# EAGLE design untitled (EAGLE 5.06)
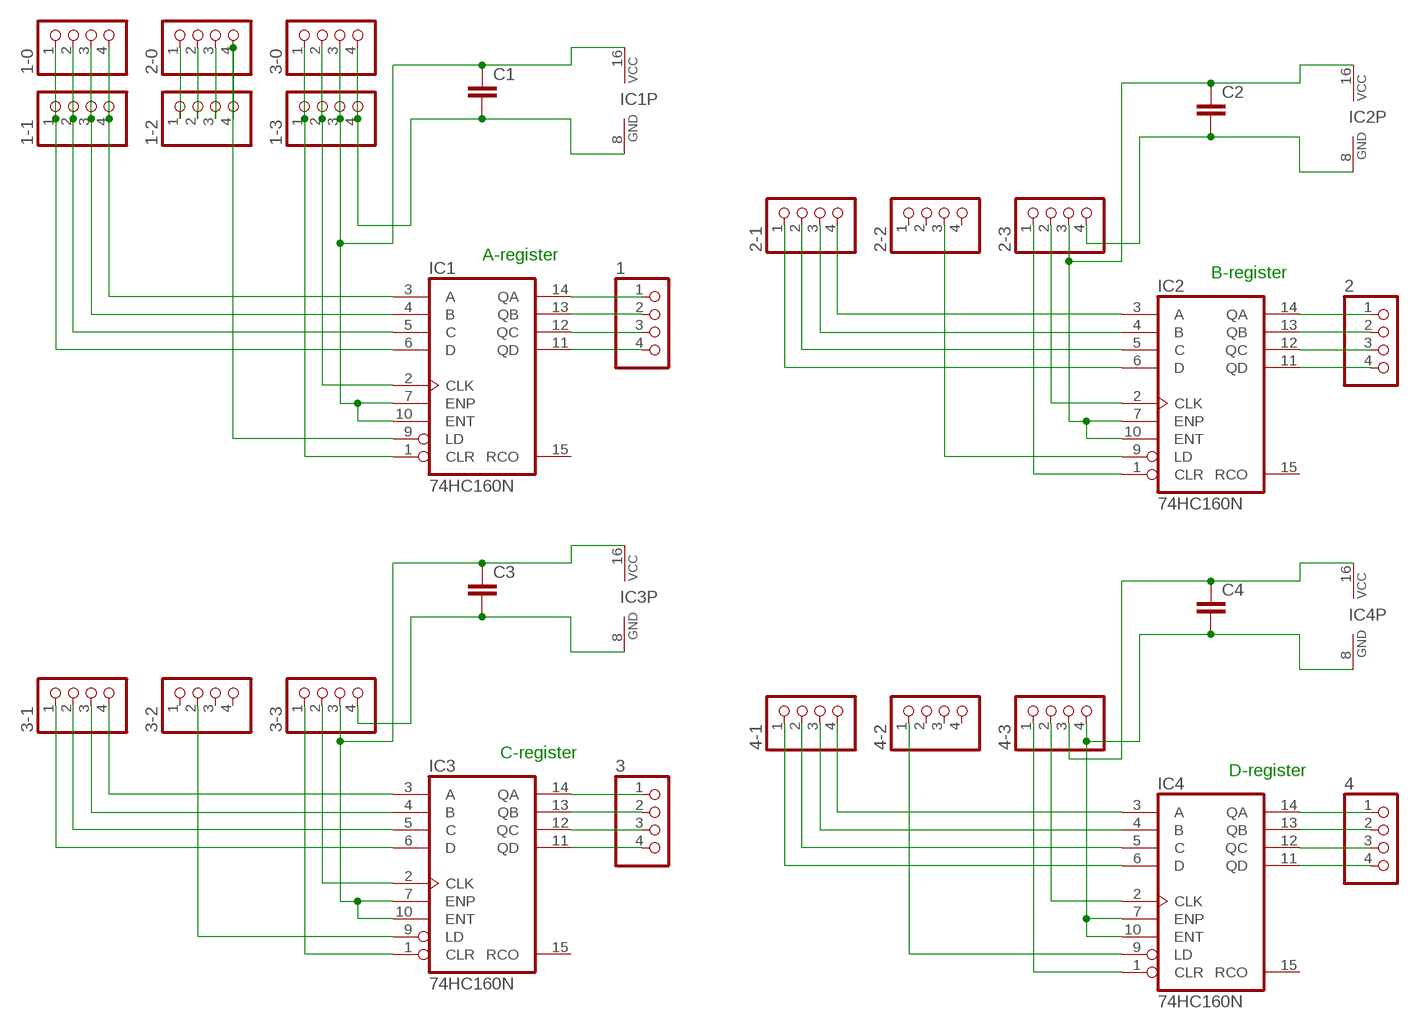
[diagram p0: schematic, sheet 1]

## Parts
1  PINHD-1X4  [1X04]
1-0  PINHD-1X4  [1X04]
1-1  PINHD-1X4  [1X04]
1-2  PINHD-1X4  [1X04]
1-3  PINHD-1X4  [1X04]
2  PINHD-1X4  [1X04]
2-0  PINHD-1X4  [1X04]
2-1  PINHD-1X4  [1X04]
2-2  PINHD-1X4  [1X04]
2-3  PINHD-1X4  [1X04]
3  PINHD-1X4  [1X04]
3-0  PINHD-1X4  [1X04]
3-1  PINHD-1X4  [1X04]
3-2  PINHD-1X4  [1X04]
3-3  PINHD-1X4  [1X04]
4  PINHD-1X4  [1X04]
4-1  PINHD-1X4  [1X04]
4-2  PINHD-1X4  [1X04]
4-3  PINHD-1X4  [1X04]
C1  C-EU050-030X075  [C050-030X075]
C2  C-EU050-030X075  [C050-030X075]
C3  C-EU050-030X075  [C050-030X075]
C4  C-EU050-030X075  [C050-030X075]
IC1  74HC160N  [DIL16]
IC2  74HC160N  [DIL16]
IC3  74HC160N  [DIL16]
IC4  74HC160N  [DIL16]

## Nets
N$1: 1-2.4 2-0.4 IC1.9(LD)
N$2: 2-2.3 IC2.9(LD)
N$3: 2-1.4 IC2.3(A)
N$4: 2-1.3 IC2.4(B)
N$5: 1-0.4 1-1.4 IC1.3(A)
N$6: 1-0.3 1-1.3 IC1.4(B)
N$7: 1-0.2 1-1.2 IC1.5(C)
N$8: 1-0.1 1-1.1 IC1.6(D)
N$9: 1-3.1 3-0.1 IC1.1(CLR)
N$10: 1-3.2 3-0.2 IC1.2(CLK)
N$11: 1.1 IC1.14(QA)
N$12: 1.2 IC1.13(QB)
N$13: 1.3 IC1.12(QC)
N$14: 1.4 IC1.11(QD)
N$15: 2-1.2 IC2.5(C)
N$16: 2-1.1 IC2.6(D)
N$17: 2-3.1 IC2.1(CLR)
N$18: 2-3.2 IC2.2(CLK)
N$19: 2.1 IC2.14(QA)
N$20: 2.2 IC2.13(QB)
N$21: 2.3 IC2.12(QC)
N$22: 2.4 IC2.11(QD)
N$23: 3-2.2 IC3.9(LD)
N$24: 3-1.4 IC3.3(A)
N$25: 3-1.3 IC3.4(B)
N$26: 3-1.2 IC3.5(C)
N$27: 3-1.1 IC3.6(D)
N$28: 3-3.1 IC3.1(CLR)
N$29: 3-3.2 IC3.2(CLK)
N$30: 3.1 IC3.14(QA)
N$31: 3.2 IC3.13(QB)
N$32: 3.3 IC3.12(QC)
N$33: 3.4 IC3.11(QD)
N$34: 4-2.1 IC4.9(LD)
N$35: 4-1.4 IC4.3(A)
N$36: 4-1.3 IC4.4(B)
N$37: 4-1.2 IC4.5(C)
N$38: 4-1.1 IC4.6(D)
N$39: 4-3.1 IC4.1(CLR)
N$40: 4-3.2 IC4.2(CLK)
N$41: 4.1 IC4.14(QA)
N$42: 4.2 IC4.13(QB)
N$43: 4.3 IC4.12(QC)
N$44: 4.4 IC4.11(QD)
N$45: 1-2.1 2-0.1
N$46: 1-2.2 2-0.2
N$47: 1-2.3 2-0.3
N$48: 1-3.3 3-0.3 C1.1 IC1.7(ENP) IC1.10(ENT) IC1.16(VCC)
N$49: 1-3.4 3-0.4 C1.2 IC1.8(GND)
N$50: 3-3.3 C3.1 IC3.7(ENP) IC3.10(ENT) IC3.16(VCC)
N$51: 3-3.4 C3.2 IC3.8(GND)
N$52: 4-3.4 C4.2 IC4.7(ENP) IC4.8(GND) IC4.10(ENT)
N$53: 4-3.3 C4.1 IC4.16(VCC)
N$54: 2-3.3 C2.1 IC2.7(ENP) IC2.10(ENT) IC2.16(VCC)
N$55: 2-3.4 C2.2 IC2.8(GND)
Unconnected: 2-2.1 2-2.2 2-2.4 3-2.1 3-2.3 3-2.4 4-2.2 4-2.3 4-2.4 IC1.15(RCO) IC2.15(RCO) IC3.15(RCO) IC4.15(RCO)

## Notes on the sheet
- A-register
- B-register
- C-register
- D-register

## Library data of the parts
1 1-0 1-1-1-3 2 2-0 2-1-2-3 3 3-0 3-1-3-3 4 4-1-4-3 = pinhead:PINHD-1X4: PIN HEADER
C1-C4 = resistor:C-EU: CAPACITOR, European symbol
IC1-IC4 = 74xx-eu:74*160: Synchronous 4-bit COUNTER

## Board
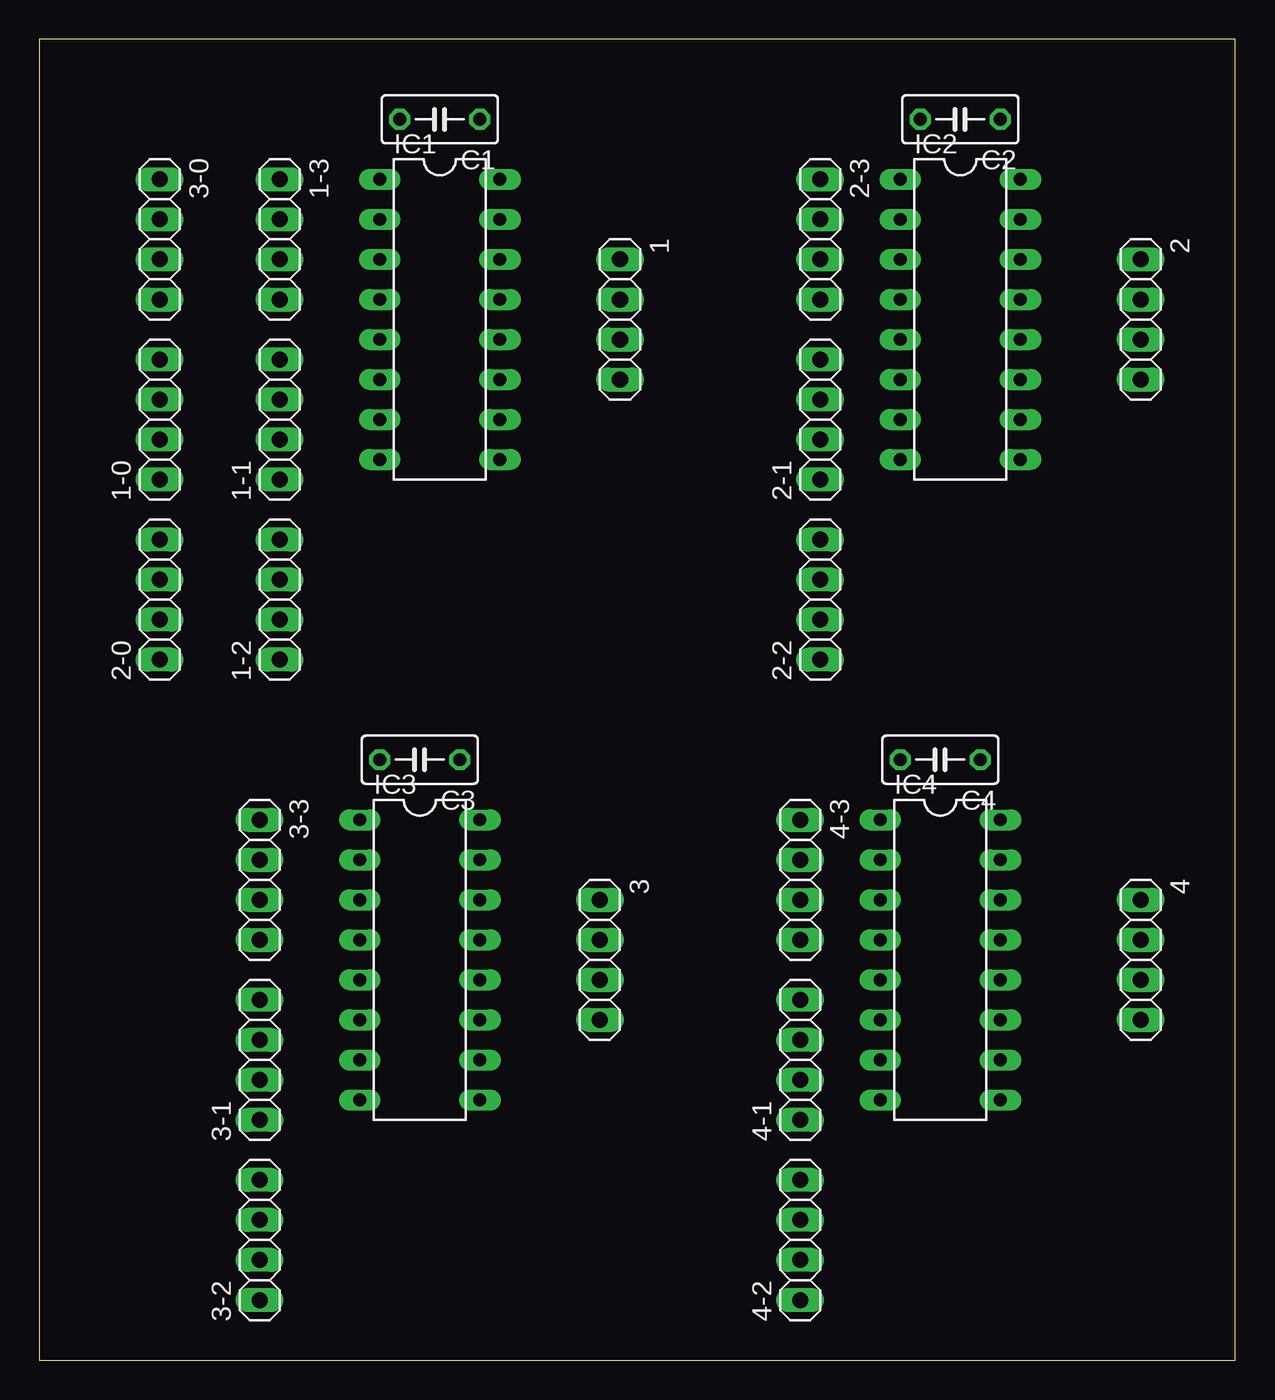
[diagram p1: board, top side]
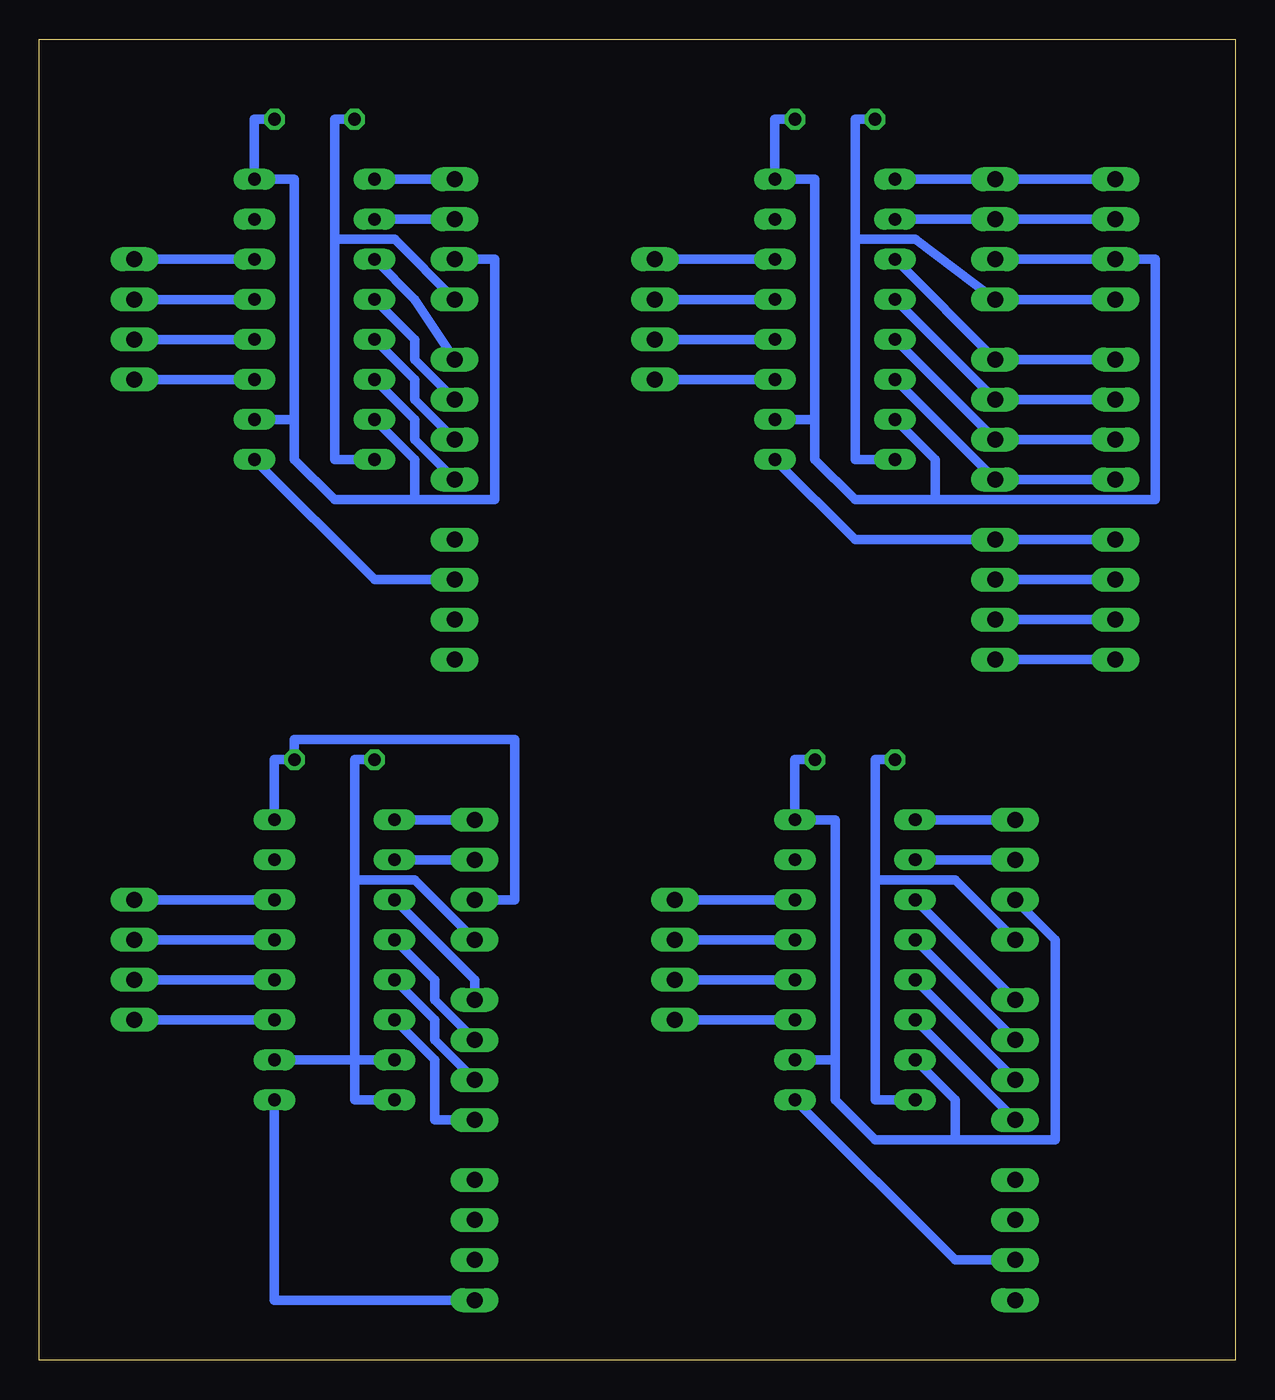
[diagram p2: board, bottom side, seen from below]

Size 75.87 x 83.81 mm. Coordinates in mm from the lower left corner, seen from the top.
Outline: 0,0 75.87,0 75.87,83.81 0,83.81 0,0
Copper layers (1*16): Top 0.035mm / dielectric 1.5mm / Bottom 0.035mm
Design rules "default": minimum track width 10mil, minimum drill 24mil, track to track 8mil, track to pad 8mil, pad to pad 8mil, via to via 8mil, smd to smd 8mil, copper to edge 40mil, drill to drill 8mil, minimum pad ring 10mil, minimum via ring 8mil, stop-mask expansion 4mil, vias tented up to drill 0mil, thermal gap 10mil

### Footprints (pad centres in the part's own frame; a part is rotated, then mirrored left to right if it is on the bottom)
1X04 = drill 1.016 long: 1 -3.81,0; 2 -1.27,0; 3 1.27,0; 4 3.81,0
C050-030X075 = drill 0.813 octagon: 1 -2.54,0; 2 2.54,0
DIL16 = drill 0.813 long: 1 -8.89,-3.81; 2 -6.35,-3.81; 3 -3.81,-3.81; 4 -1.27,-3.81; 5 1.27,-3.81; 6 3.81,-3.81; 7 6.35,-3.81; 8 8.89,-3.81; 9 8.89,3.81; 10 6.35,3.81; 11 3.81,3.81; 12 1.27,3.81; 13 -1.27,3.81; 14 -3.81,3.81; 15 -6.35,3.81; 16 -8.89,3.81

### Placement (x,y rotation side)
1  36.83,66.04 270 top
1-0  7.62,59.69 90 top
1-1  15.24,59.69 90 top
1-2  15.24,48.26 90 top
1-3  15.24,71.12 270 top
2  69.85,66.04 270 top
2-0  7.62,48.26 90 top
2-1  49.53,59.69 90 top
2-2  49.53,48.26 90 top
2-3  49.53,71.12 270 top
3  35.56,25.4 270 top
3-0  7.62,71.12 270 top
3-1  13.97,19.05 90 top
3-2  13.97,7.62 90 top
3-3  13.97,30.48 270 top
4  69.85,25.4 270 top
4-1  48.26,19.05 90 top
4-2  48.26,7.62 90 top
4-3  48.26,30.48 270 top
C1  25.4,78.74 180 top
C2  58.42,78.74 180 top
C3  24.13,38.1 180 top
C4  57.15,38.1 180 top
IC1  25.4,66.04 270 top
IC2  58.42,66.04 270 top
IC3  24.13,25.4 270 top
IC4  57.15,25.4 270 top

### Tracks (layer width: path | path; a pad name or v marks a point on that pad's centre or on a via)
N$1
  Bottom 0.61: IC1.9 24.13,52.07 1-2.4 2-0.4
N$2
  Bottom 0.61: IC2.9 54.61,49.53 2-2.3
N$3
  Bottom 0.61: IC2.3 52.07,67.31 2-1.4
N$4
  Bottom 0.61: IC2.4 52.07,64.77 52.07,63.5 2-1.3
N$5
  Bottom 0.61: IC1.3 1-1.4 1-0.4
N$6
  Bottom 0.61: IC1.4 1-1.3 1-0.3
N$7
  Bottom 0.61: IC1.5 1-1.2 1-0.2
N$8
  Bottom 0.61: IC1.6 1-1.1 1-0.1
N$9
  Bottom 0.61: IC1.1 1-3.1 3-0.1
N$10
  Bottom 0.61: IC1.2 1-3.2 3-0.2
N$11
  Bottom 0.61: IC1.14 1.1
N$12
  Bottom 0.61: IC1.13 1.2
N$13
  Bottom 0.61: IC1.12 1.3
N$14
  Bottom 0.61: IC1.11 1.4
N$15
  Bottom 0.61: IC2.5 52.07,62.23 52.07,60.96 2-1.2
N$16
  Bottom 0.61: IC2.6 52.07,59.69 52.07,58.42 2-1.1
N$17
  Bottom 0.61: 2-3.1 IC2.1
N$18
  Bottom 0.61: 2-3.2 IC2.2
N$19
  Bottom 0.61: IC2.14 2.1
N$20
  Bottom 0.61: IC2.13 2.2
N$21
  Bottom 0.61: IC2.12 2.3
N$22
  Bottom 0.61: IC2.11 2.4
N$23
  Bottom 0.61: IC3.9 17.78,6.35 3-2.2
N$24
  Bottom 0.61: 3-1.4 IC3.3
N$25
  Bottom 0.61: 3-1.3 IC3.4
N$26
  Bottom 0.61: 3-1.2 IC3.5
N$27
  Bottom 0.61: 3-1.1 IC3.6
N$28
  Bottom 0.61: 3-3.1 IC3.1
N$29
  Bottom 0.61: 3-3.2 IC3.2
N$30
  Bottom 0.61: IC3.14 3.1
N$31
  Bottom 0.61: IC3.13 3.2
N$32
  Bottom 0.61: IC3.12 3.3
N$33
  Bottom 0.61: IC3.11 3.4
N$34
  Bottom 0.61: IC4.9 60.96,3.81 4-2.1
N$35
  Bottom 0.61: IC4.3 48.26,24.13 4-1.4
N$36
  Bottom 0.61: IC4.4 50.8,24.13 50.8,22.86 4-1.3
N$37
  Bottom 0.61: IC4.5 50.8,21.59 50.8,20.32 4-1.2
N$38
  Bottom 0.61: IC4.6 50.8,19.05 50.8,15.24 4-1.1
N$39
  Bottom 0.61: 4-3.1 IC4.1
N$40
  Bottom 0.61: 4-3.2 IC4.2
N$41
  Bottom 0.61: IC4.14 4.1
N$42
  Bottom 0.61: IC4.13 4.2
N$43
  Bottom 0.61: IC4.12 4.3
N$44
  Bottom 0.61: IC4.11 4.4
N$45
  Bottom 0.61: 2-0.1 1-2.1
N$46
  Bottom 0.61: 2-0.2 1-2.2
N$47
  Bottom 0.61: 2-0.3 1-2.3
N$48
  Bottom 0.61: C1.1 29.21,78.74 IC1.16 26.67,74.93 26.67,59.69 | 1-3.3 3-0.3 5.08,69.85 5.08,54.61 19.05,54.61 | IC1.7 19.05,57.15 19.05,54.61 | 19.05,54.61 24.13,54.61 26.67,57.15 26.67,59.69 | IC1.10 26.67,59.69
N$49
  Bottom 0.61: C1.2 24.13,78.74 24.13,71.12 | 24.13,71.12 24.13,57.15 IC1.8 | 3-0.4 1-3.4 20.32,71.12 24.13,71.12
N$50
  Bottom 0.61: C3.1 27.94,38.1 IC3.16 25.4,34.29 25.4,19.05 | IC3.7 17.78,16.51 17.78,13.97 | 17.78,13.97 22.86,13.97 25.4,16.51 25.4,19.05 | 3-3.3 11.43,26.67 11.43,13.97 17.78,13.97 | IC3.10 25.4,19.05
N$51
  Bottom 0.61: C3.2 22.86,38.1 22.86,30.48 | 22.86,30.48 22.86,16.51 IC3.8 | 3-3.4 17.78,30.48 22.86,30.48
N$52
  Bottom 0.61: C4.2 55.88,38.1 55.88,30.48 | 55.88,19.05 55.88,16.51 IC4.8 | 55.88,19.05 55.88,30.48 | 55.88,19.05 IC4.7 | 55.88,19.05 IC4.10 | 4-3.4 52.07,30.48 55.88,30.48
N$53
  Bottom 0.61: IC4.16 60.96,38.1 C4.1 59.69,39.37 45.72,39.37 45.72,29.21 4-3.3
N$54
  Bottom 0.61: C2.1 62.23,78.74 IC2.16 59.69,74.93 59.69,59.69 | IC2.7 52.07,57.15 52.07,54.61 | 2-3.3 46.99,69.85 46.99,54.61 52.07,54.61 | 59.69,59.69 IC2.10 | 59.69,59.69 59.69,57.15 57.15,54.61 52.07,54.61
N$55
  Bottom 0.61: C2.2 57.15,78.74 57.15,71.12 | 57.15,71.12 57.15,57.15 IC2.8 | 2-3.4 53.34,71.12 57.15,71.12